# Altium schematic sheet Battery.SchDoc: Power
size A3; SheetNumber: 4; SheetTotal: 11
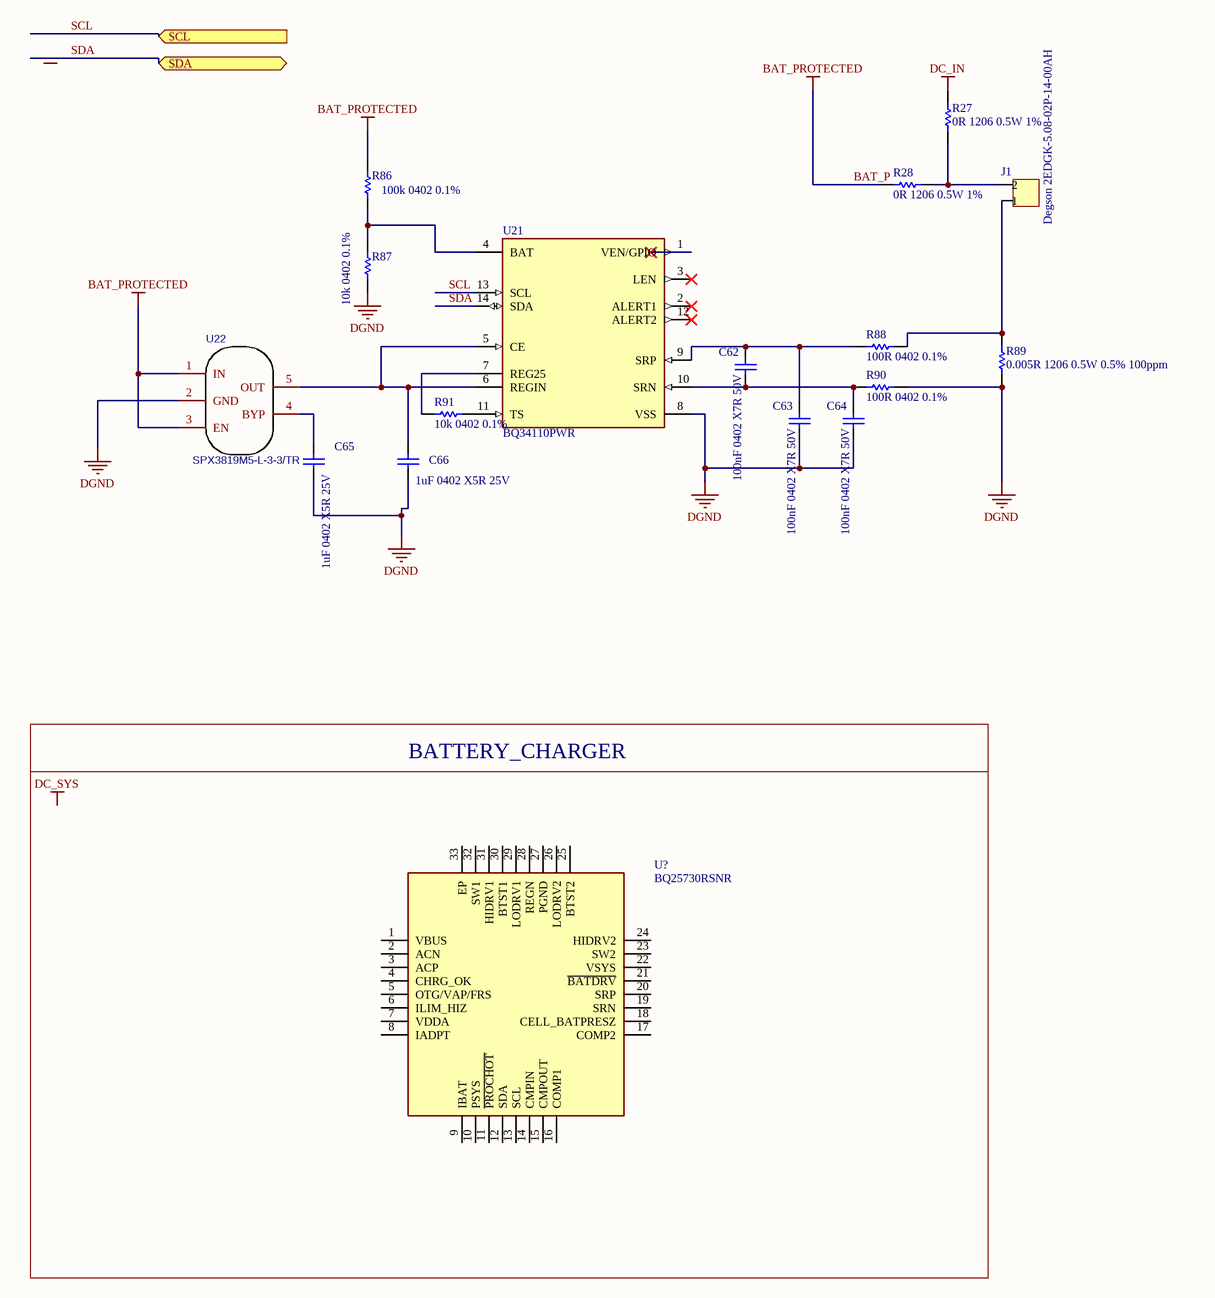
[diagram p0: Battery.SchDoc]

## Parts
C62  100nF 0402 X7R 50V  [CAPC1005X55X25NL5T10]
C63  100nF 0402 X7R 50V  [CAPC1005X55X25NL5T10]
C64  100nF 0402 X7R 50V  [CAPC1005X55X25NL5T10]
C65  1uF 0402 X5R 25V  [CAPC1005X55X25NL5T10]
C66  1uF 0402 X5R 25V  [CAPC1005X55X25NL5T10]
J1  Degson 2EDGK-5.08-02P-14-00AH  [PCB-h4cyb3wxd4gf7j132tzl-1]
R27  0R 1206 0.5W 1%  [CAPC3216X180X55ML20T25]
R28  0R 1206 0.5W 1%  [CAPC3216X180X55ML20T25]
R86  100k 0402 0.1%  [RESC1005X40X25ML05T10]
R87  10k 0402 0.1%  [RESC1005X40X25ML05T10]
R88  100R 0402 0.1%  [RESC1005X40X25ML05T10]
R89  0.005R 1206 0.5W 0.5% 100ppm  [CAPC3216X180X55ML20T25]
R90  100R 0402 0.1%  [RESC1005X40X25ML05T10]
R91  10k 0402 0.1%  [RESC1005X40X25ML05T10]
U21  BQ34110PWR  [FP-PW0014A-MFG]
U22  SPX3819M5-L-3-3/TR  [SOT-23-5_L3.0-W1.7-P0.95-LS2.8-BR]
U?  BQ25730RSNR  [QFN40P400X400X80-33N-D]

## Blocks framed on the sheet
BATTERY_CHARGER: U?

## Ports
SCL (in), SDA (bidir)

## Nets
BAT_P: R28.1 R86.2 U22.1(IN) U22.3(EN)  [also labelled BAT_PROTECTED]
DC_IN: R27.1
DGND: C63.1 C64.1 C65.1 C66.1 R87.1 R89.2 R90.1 U21.8(VSS) U22.2(GND)
SCL: U21.13(SCL) ; port SCL
SDA: U21.14(SDA) ; port SDA
NetC62_1: C62.1 C64.2 R90.2 U21.10(SRN)
NetC62_2: C62.2 C63.2 R88.2 U21.9(SRP)
NetC65_2: C65.2 U22.4(BYP)
NetC66_2: C66.2 U21.5(CE) U21.6(REGIN) U22.5(OUT)
NetJ1_1: J1.1 R88.1 R89.1
NetJ1_2: J1.2 R27.2 R28.2
NetR86_1: R86.1 R87.2 U21.4(BAT)
NetR91_1: R91.1 U21.11(TS)
NetR91_2: R91.2 U21.7(REG25)

Not connected (* = marked no-connect by the designer): U21 1(VEN/GPIO)* 2(ALERT1)* 3(LEN)* 12(ALERT2)*; U? 1(VBUS) 2(ACN) 3(ACP) 4(CHRG_OK) 5(OTG/VAP/FRS) 6(ILIM_HIZ) 7(VDDA) 8(IADPT) 9(IBAT) 10(PSYS) 11(~{PROCHOT}) 12(SDA) 13(SCL) 14(CMPIN) 15(CMPOUT) 16(COMP1) 17(COMP2) 18(CELL_BATPRESZ) 19(SRN) 20(SRP) 21(~{BATDRV}) 22(VSYS) 23(SW2) 24(HIDRV2) 25(BTST2) 26(LODRV2) 27(PGND) 28(REGN) 29(LODRV1) 30(BTST1) 31(HIDRV1) 32(SW1) 33(EP)

## Notes on the sheet
- Labels drawn without touching a wire or pin: DC_SYS
- Title
- Size:
- Date:
- A3
- Author:
- Time:
- Revision:
- Sheet
- of
- File:

## Library data of the parts
C62-C66 = CMP-1662-00020-1: ComponentLink2Description: Datasheet; ComponentLink2URL: http://psearch.en.murata.com/capacitor/product/GRM155R60J105KE19%23.pdf; ComponentLink1Description: Manufacturer URL; ComponentLink1URL: http://www.murata.com/
  C62-C64: LCSC_PN: C77020
  C65 C66: LCSC_PN: C77009
J1 = CMP-7a42b7ee166ba585-1: Terminal block, 5mm 2 Pos, through hole male.; Manufacturer Part Number: 2EDGK-5.08-02P-14-00AH + 2EDGVC-5.08-02P; Octopart URL: https://octopart.com/2edgk-5.08-02p-14-00ah-degson-78006607; OctopartID: 7a42b7ee166ba585; Manufacturer Part Number 2: WJ2EDGVC-5.08-2P + WJ2EDGK-5.08-2P; LCSC Part: C8445; LCSC_PN: C8445
R27 R28 = CMP-0abdc173b10ad57a-1: Manufacturer Part Number: WSLP12065L000FEA; Resistance: 0,002; Power: 1W; Octopart URL: https://octopart.com/1-2176055-0-te+connectivity-46440145; Case/Package: 1206; Lifecycle Status: Not Listed by Manufacturer; Packaging: Tape & Reel (TR); OctopartID: 0abdc173b10ad57a; OrderingCode: WSLP12065L000FEA; Manufacturer Part Number 2: FMF06FTHR005-LHL; LCSC_PN: C108081
R86-R88 R90 R91 = CMP-2002-07472-1
  R86: LCSC_PN: C60491
  R87 R91: LCSC_PN: C190095
  R88 R90: LCSC_PN: C106233
R89 = CMP-0abdc173b10ad57a-1: 0.002R 1206 0.5W 1%; Manufacturer Part Number: WSLP12065L000FEA; Resistance: 0,005; Power: 1W; Octopart URL: https://octopart.com/1-2176055-0-te+connectivity-46440145; Case/Package: 1206; Lifecycle Status: Not Listed by Manufacturer; Packaging: Tape & Reel (TR); OctopartID: 0abdc173b10ad57a; OrderingCode: WSLP12065L000FEA; Manufacturer Part Number 2: FMF06FTHR005-LHL; LCSC_PN: C723507
U21 = CMP-04911-000003-1: IC BATT MON MULTICELL 14TSSOP; Manufacturer: Texas Instruments; Number Of Outputs: 2; Max Junction Temp: +100°C; Max Supply Voltage: 4.5V; Min Supply Voltage: 2.45V; Number Of Cells: 4; Standoff Height: 0.05mm; Nominal Supply Current: 133uA; Package: PW0014A; Temperature Range High: +85°C; Octopart: https://octopart.com/bq34110pwr-texas+instruments-75529711; ComponentLink2URL: https://www.ti.com/lit/ds/symlink/bq34110.pdf; Device Class L1: Integrated Circuits (ICs); Height: 1.2mm; Device Class L3: Battery Management; Temperature Range Low: -40°C; RoHS: TRUE; Digikey Description: IC BATT MON MULTICELL 14TSSOP; Device Class L2: Power Management ICs; Manufacturer Part Number: BQ34110PWR; Lead Free: Yes; ComponentLink2Description: Datasheet; Category: IC; Automotive: No; Mouser Description: Multi-Chemistry High-Cell Count Battery Fuel Gauge With Integrated Rarely Discharged Module 14-TSSOP -40 to 85; Temperature: -40°C to +85°C; Ambient Temperature Range Low: -40°C; Ambient Temperature Range High: +85°C; LCSC_PN: C2877075
U22 = SPX3819M5-L-3-3/TR: BOM_Manufacturer: EXAR; BOM_Supplier: LCSC; BOM_Manufacturer Part: SPX3819M5-L-3-3/TR; BOM_Supplier Part: C9055; BOM_JLCPCB Part Class: Extended Part; spicePre: U; spiceSymbolName: SPX3819M5-L-3-3/TR; LCSC_PN: C9055
U? = BQ25730RSNR: Integrated Circuit; Manufacturer_Name: Texas Instruments; Datasheet Link: https://www.ti.com/lit/ds/symlink/bq25730.pdf?ts=1623420063043&ref_url=https%253A%252F%252Fwww.ti.com%252Fstore%252Fti%252Fen%252Fp%252Fproduct%252F%253Fp%253DBQ25730RSNR; Height: 0.8mm; Manufacturer_Part_Number: BQ25730RSNR; Mouser Part Number: 595-BQ25730RSNR; Mouser Price/Stock: https://www.mouser.co.uk/ProductDetail/Texas-Instruments/BQ25730RSNR?qs=stqOd1AaK78USmb51n%2Fwlg%3D%3D; Arrow Part Number: BQ25730RSNR; Arrow Price/Stock: https://www.arrow.com/en/products/bq25730rsnr/texas-instruments?region=nac